# EAGLE design 4amppowersupply (EAGLE 9.6.2)
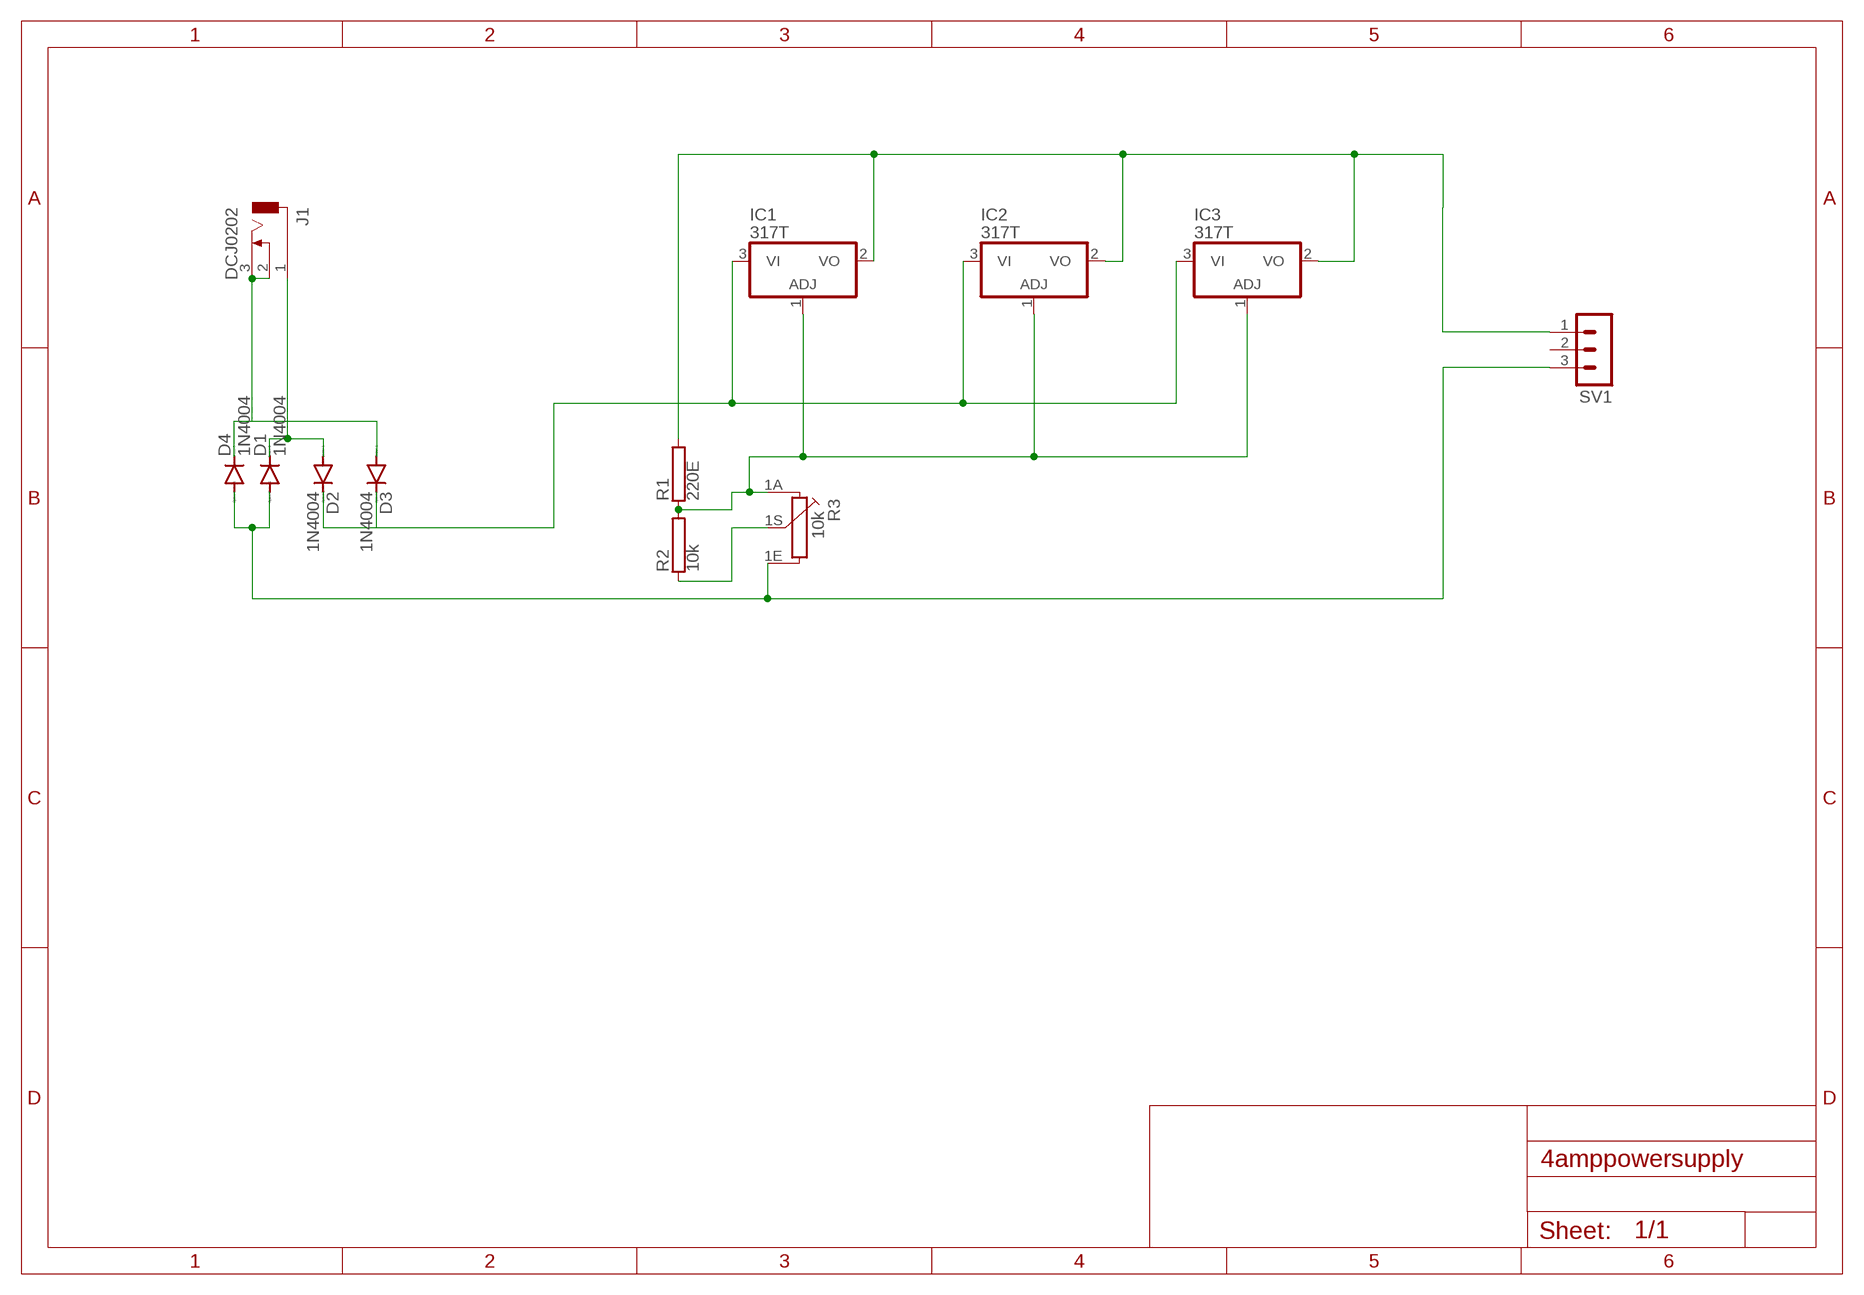
[diagram p0: schematic, sheet 1]

## Parts
D1  1N4004  [DO41-10]
D2  1N4004  [DO41-10]
D3  1N4004  [DO41-10]
D4  1N4004  [DO41-10]
IC1  317T  [TO220H]
IC2  317T  [TO220H]
IC3  317T  [TO220H]
J1  DCJ0202  [DCJ0202]
R1  220E  RMG100-V  [TO-247-2V]
R2  10k  RMG100-V  [TO-247-2V]
R3  10k  PC16S  [PC16S]
SV1  MA03-1  [MA03-1]

## Nets
N$1: D3.A D4.C J1.2 J1.3
N$2: D1.C D2.A J1.1
N$3: D1.A D4.A R3.1E SV1.3
N$4: D2.C D3.C IC1.3(VI) IC2.3(VI) IC3.3(VI)
N$5: IC1.1(ADJ) IC2.1(ADJ) IC3.1(ADJ) R1.1 R2.2 R3.1A
N$6: R2.1 R3.1S
N$7: IC1.2(VO) IC2.2(VO) IC3.2(VO) R1.2 SV1.1
Unconnected: SV1.2

## Library data of the parts
D1-D4 = diode:1N4004: DIODE general purpose rectifier, 1 A
IC1-IC3 = linear:*317: Positive VOLTAGE REGULATOR
J1 = con-jack:DCJ0202: DC POWER JACK Source: DCJ0202.pdf; OC_FARNELL: unknown; OC_NEWARK: unknown
R1 R2 = resistor-power:RMG100: TO-247 Power Resistor - RMG 100 Series Source: www.token.com.tw .. power-resistor-rmg100pdf; OC_FARNELL: unknown; OC_NEWARK: unknown
R3 = piher:PC16S: POTENTIOMETER single carbon potentiometer, 16 mm, S3ROH; OC_FARNELL: 4452940; OC_NEWARK: unknown
SV1 = con-lstb:MA03-1: PIN HEADER; OC_FARNELL: unknown; OC_NEWARK: unknown

## Net classes
0 default: width 0.305 mm, drill 0.508 mm, clearance 0.254 mm

## Board
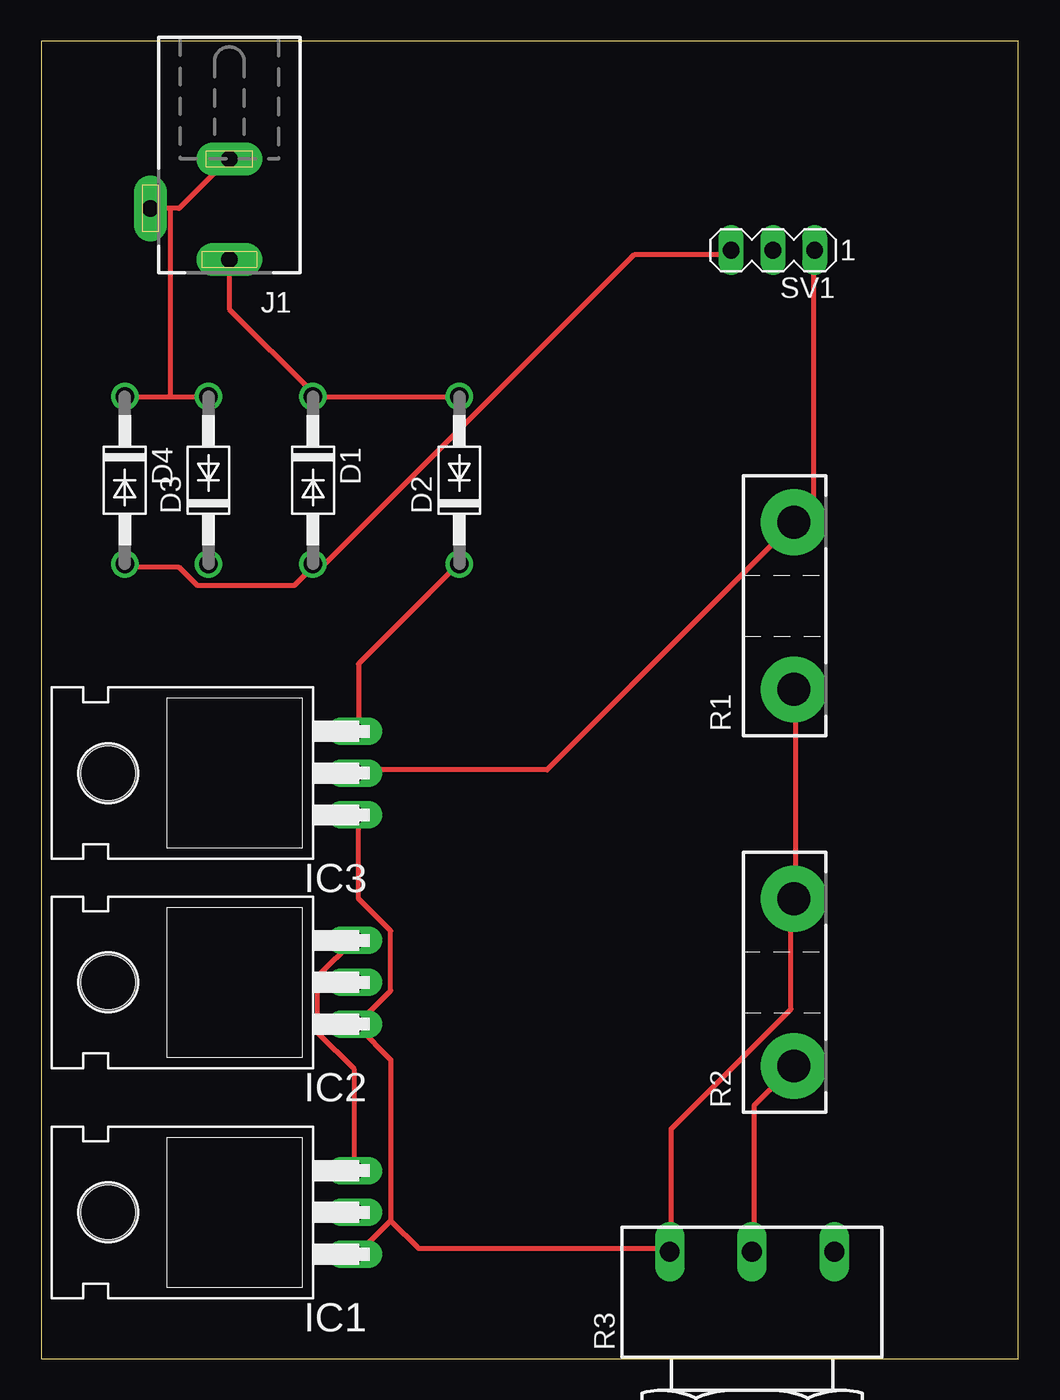
[diagram p1: board, top side]
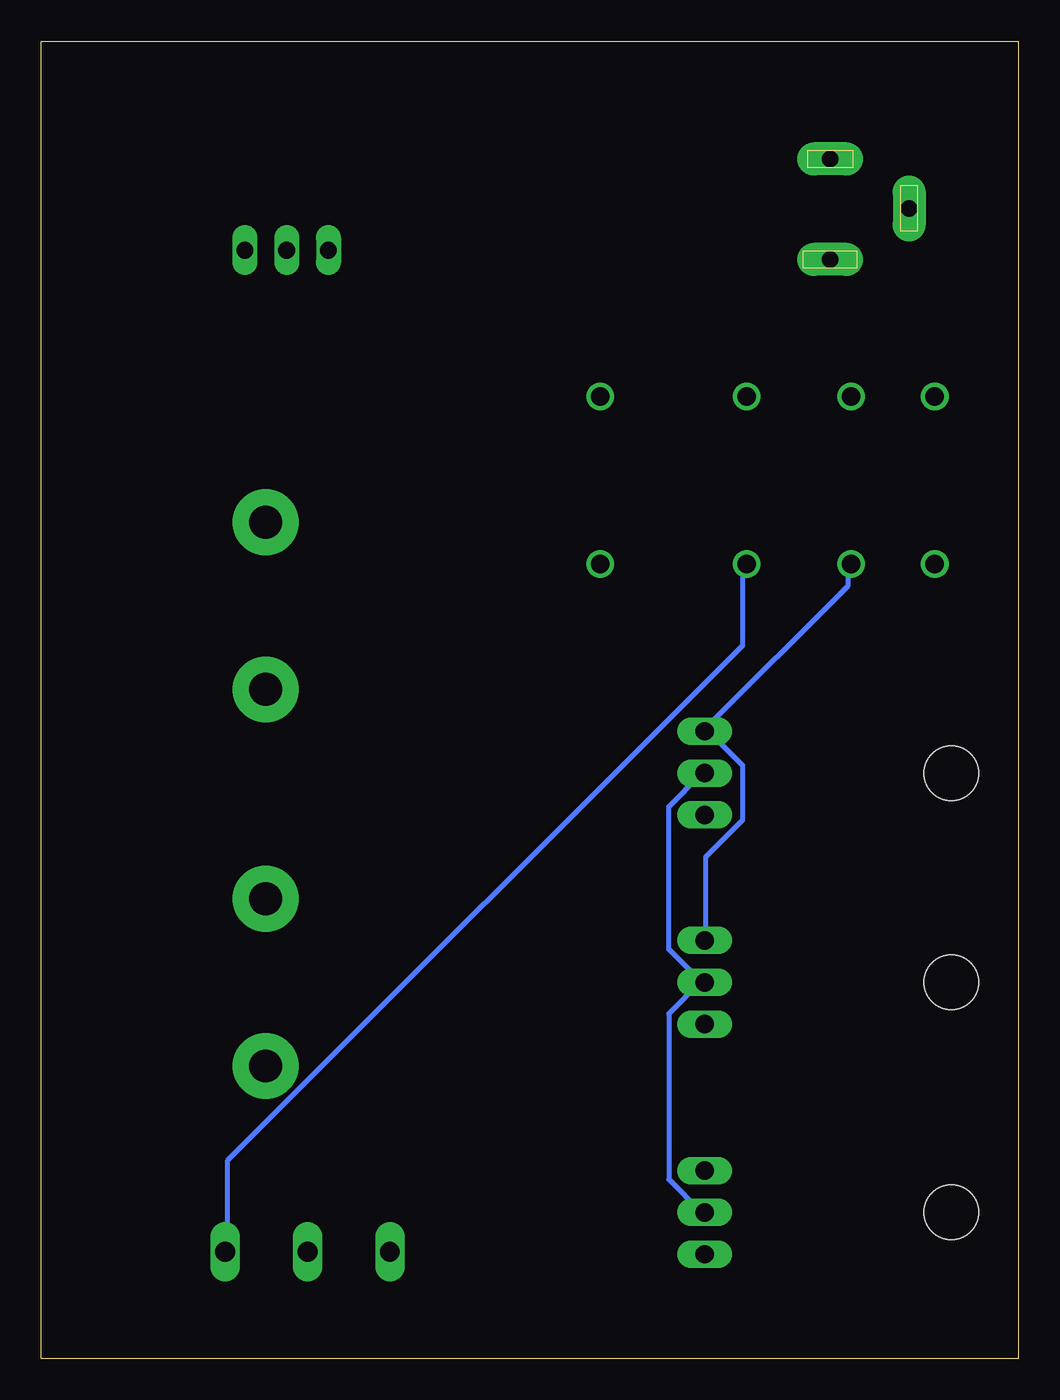
[diagram p2: board, bottom side, seen from below]

Size 59.36 x 80 mm. Coordinates in mm from the lower left corner, seen from the top.
Outline: 0,0 59.36,0 59.36,80 0,80 0,0
Copper layers (1*16): Top 0.035mm / dielectric 1.5mm / Bottom 0.035mm
Design rules "default": minimum track width 6mil, minimum drill 0.35mm, track to track 6mil, track to pad 6mil, pad to pad 6mil, via to via 6mil, smd to smd 6mil, copper to edge 40mil, drill to drill 6mil, minimum pad ring 10mil, minimum via ring 8mil, stop-mask expansion 4mil, vias tented up to drill 0mil, thermal gap 10mil

### Footprints (pad centres in the part's own frame; a part is rotated, then mirrored left to right if it is on the bottom)
DO41-10 = drill 1.118: A 5.08,0; C -5.08,0
TO220H = drill 1.118 long: 1 -2.54,-10.16; 2 0,-10.16; 3 2.54,-10.16 | hole 3.302: 0,4.826
DCJ0202 = drill 1 pad 2 long: 1 0,3.1; 2 4.8,0; 3 0,-3
TO-247-2V = drill 2 pad 4: 1 -5.08,0; 2 5.08,0
PC16S = drill 1.2 long: 1A -5,6.5; 1E 5,6.5; 1S 0,6.5
MA03-1 = drill 1.016 long: 1 -2.54,0; 2 0,0; 3 2.54,0

### Placement (x,y rotation side)
D1  16.51,53.34 270 top
D2  25.4,53.34 90 top
D3  10.16,53.34 90 top
D4  5.08,53.34 270 top
IC1  8.89,8.89 90 top
IC2  8.89,22.86 90 top
IC3  8.89,35.56 90 top
J1  11.43,69.85 180 top
R1  45.72,45.72 90 top
R2  45.72,22.86 90 top
R3  43.18,0 0 top
SV1  44.45,67.31 180 top

### Tracks (layer width: path | path; a pad name or v marks a point on that pad's centre or on a via)
N$1
  Top 0.305: 7.82,58.4 10.06,58.4 D3.A | 7.82,58.4 5.31,58.4 D4.C | 7.82,69.85 8.38,69.85 11.18,72.64 J1.3 | 7.82,69.85 J1.2 | 7.82,69.85 7.82,58.4
N$2
  Top 0.305: D2.A 25.15,58.4 16.76,58.4 D1.C 16.48,58.67 11.46,63.7 11.46,66.5 J1.1
N$3
  Top 0.305: SV1.3 41.91,67.06 36.04,67.06 17.32,48.34 16.76,48.34 D1.A 16.48,48.06 15.37,46.94 9.5,46.94 8.38,48.06 5.31,48.06 D4.A
  Bottom 0.305: R3.1E 48.06,6.71 48.06,12.01 16.76,43.31 16.76,48.06 D1.A
N$4
  Top 0.305: IC1.3 19,11.46 19,17.6 16.76,19.84 16.76,23.19 19,25.43 IC2.3 | IC3.3 19.28,38.28 19.28,42.19 25.15,48.06 D2.C
  Bottom 0.305: 19,38.28 10.34,46.94 10.34,48.06 D3.C | 19,38.28 16.76,36.04 16.76,32.69 19,30.45 19,25.43 IC2.3 | 19,38.28 IC3.3
N$5
  Top 0.305: R1.1 45.82,40.51 45.82,27.94 R2.2 45.54,27.94 45.54,21.23 38.28,13.97 38.28,6.71 R3.1A 38,6.71 22.91,6.71 21.23,8.38 | 21.23,8.38 19.28,6.43 IC1.1 | 21.23,8.38 21.23,18.16 19.28,20.12 IC2.1 19.28,20.4 21.23,22.35 21.23,25.98 19.28,27.94 19.28,32.97 IC3.1
N$6
  Top 0.305: R2.1 43.31,15.37 43.31,6.71 R3.1S
N$7
  Top 0.305: SV1.1 46.94,67.06 46.94,51.97 45.82,50.85 R1.2 45.54,50.57 30.73,35.76 19.28,35.76 IC3.2
  Bottom 0.305: 19.28,22.91 21.23,20.95 21.23,10.9 19.28,8.94 IC1.2 | 19.28,22.91 21.23,24.87 21.23,33.53 19.28,35.48 IC3.2 | 19.28,22.91 IC2.2